# EAGLE design Module_I2C_GPIO (EAGLE 9.6.2)
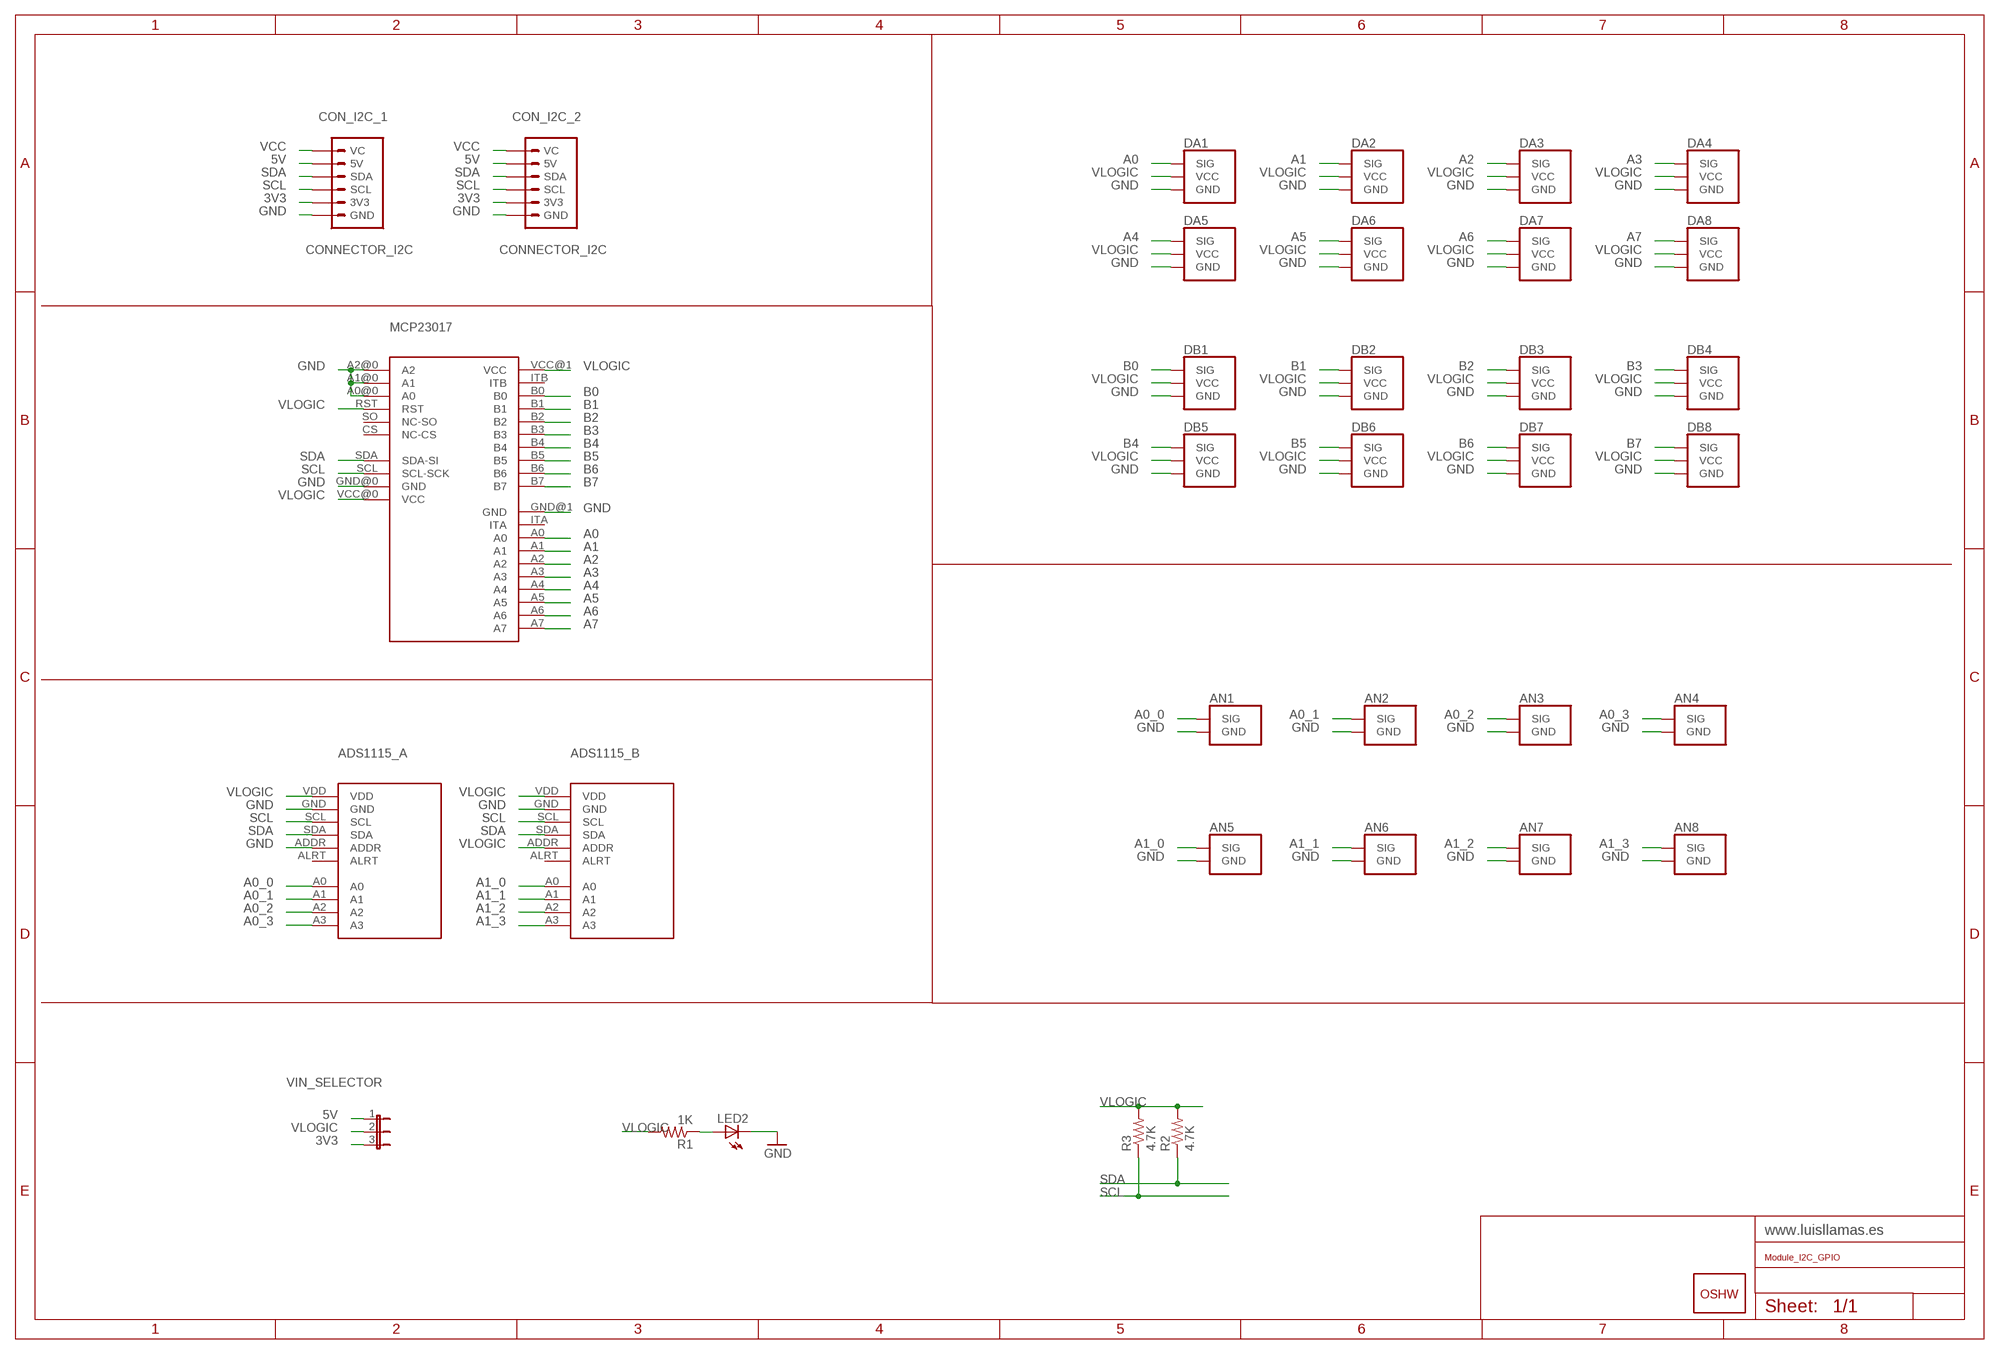
[diagram p0: schematic, sheet 1]

## Parts
ADS1115_A  ADC-4CH-ADS1115  [ADC-4CH-ADS1115]
ADS1115_B  ADC-4CH-ADS1115  [ADC-4CH-ADS1115]
AN1  SERVO_2  [SERVO_2]
AN2  SERVO_2  [SERVO_2]
AN3  SERVO_2  [SERVO_2]
AN4  SERVO_2  [SERVO_2]
AN5  SERVO_2  [SERVO_2]
AN6  SERVO_2  [SERVO_2]
AN7  SERVO_2  [SERVO_2]
AN8  SERVO_2  [SERVO_2]
CON_I2C_1  CONNECTOR_I2C  [CONNECTOR_I2C]
CON_I2C_2  CONNECTOR_I2C  [CONNECTOR_I2C]
DA1  SERVOSERVO  [SERVO]
DA2  SERVOSERVO  [SERVO]
DA3  SERVOSERVO  [SERVO]
DA4  SERVOSERVO  [SERVO]
DA5  SERVOSERVO  [SERVO]
DA6  SERVOSERVO  [SERVO]
DA7  SERVOSERVO  [SERVO]
DA8  SERVOSERVO  [SERVO]
DB1  SERVOSERVO  [SERVO]
DB2  SERVOSERVO  [SERVO]
DB3  SERVOSERVO  [SERVO]
DB4  SERVOSERVO  [SERVO]
DB5  SERVOSERVO  [SERVO]
DB6  SERVOSERVO  [SERVO]
DB7  SERVOSERVO  [SERVO]
DB8  SERVOSERVO  [SERVO]
GOLD_ORB_SM1  OSHWLOGO_GOLD_ORB_MED  [OSHW1]
LED2  LEDCHIP-LED0805  [CHIP-LED0805]
MCP23017  GPIO-I2C-MCP23017  [GPIO-I2C-MCP23017]
R1  1K  R-US_R0805  [R0805]
R2  4.7K  R-US_R0805  [R0805]
R3  4.7K  R-US_R0805  [R0805]
VIN_SELECTOR  JUMPER_3  [JUMPER_3]

## Nets
3V3: CON_I2C_1.3V3 CON_I2C_2.3V3 VIN_SELECTOR.3
5V: CON_I2C_1.5V CON_I2C_2.5V VIN_SELECTOR.1
A0: DA1.SIG MCP23017.A0
A0_0: ADS1115_A.A0 AN1.SIG
A0_1: ADS1115_A.A1 AN2.SIG
A0_2: ADS1115_A.A2 AN3.SIG
A0_3: ADS1115_A.A3 AN4.SIG
A1: DA2.SIG MCP23017.A1
A1_0: ADS1115_B.A0 AN5.SIG
A1_1: ADS1115_B.A1 AN6.SIG
A1_2: ADS1115_B.A2 AN7.SIG
A1_3: ADS1115_B.A3 AN8.SIG
A2: DA3.SIG MCP23017.A2
A3: DA4.SIG MCP23017.A3
A4: DA5.SIG MCP23017.A4
A5: DA6.SIG MCP23017.A5
A6: DA7.SIG MCP23017.A6
A7: DA8.SIG MCP23017.A7
B0: DB1.SIG MCP23017.B0
B1: DB2.SIG MCP23017.B1
B2: DB3.SIG MCP23017.B2
B3: DB4.SIG MCP23017.B3
B4: DB5.SIG MCP23017.B4
B5: DB6.SIG MCP23017.B5
B6: DB7.SIG MCP23017.B6
B7: DB8.SIG MCP23017.B7
GND: ADS1115_A.ADDR ADS1115_A.GND ADS1115_B.GND AN1.GND AN2.GND AN3.GND AN4.GND AN5.GND AN6.GND AN7.GND AN8.GND CON_I2C_1.GND CON_I2C_2.GND DA1.GND DA2.GND DA3.GND DA4.GND DA5.GND DA6.GND DA7.GND DA8.GND DB1.GND DB2.GND DB3.GND DB4.GND DB5.GND DB6.GND DB7.GND DB8.GND LED2.C MCP23017.A0@0(A0) MCP23017.A1@0(A1) MCP23017.A2@0(A2) MCP23017.GND@0(GND) MCP23017.GND@1(GND)
N$1: LED2.A R1.1
SCL: ADS1115_A.SCL ADS1115_B.SCL CON_I2C_1.SCL CON_I2C_2.SCL MCP23017.SCL(SCL-SCK) R3.1
SDA: ADS1115_A.SDA ADS1115_B.SDA CON_I2C_1.SDA CON_I2C_2.SDA MCP23017.SDA(SDA-SI) R2.1
VCC: CON_I2C_1.VC CON_I2C_2.VC
VLOGIC: ADS1115_A.VDD ADS1115_B.ADDR ADS1115_B.VDD DA1.VCC DA2.VCC DA3.VCC DA4.VCC DA5.VCC DA6.VCC DA7.VCC DA8.VCC DB1.VCC DB2.VCC DB3.VCC DB4.VCC DB5.VCC DB6.VCC DB7.VCC DB8.VCC MCP23017.RST MCP23017.VCC@0(VCC) MCP23017.VCC@1(VCC) R1.2 R2.2 R3.2 VIN_SELECTOR.2
Unconnected: ADS1115_A.ALRT ADS1115_B.ALRT MCP23017.CS(NC-CS) MCP23017.ITA MCP23017.ITB MCP23017.SO(NC-SO)

## Library data of the parts
ADS1115_A ADS1115_B = LLL_Modules:ADC-4CH-ADS1115: 4 Channel 16-Bit Analog-to-Digital Converter based on ADS1115 chip Arduino ADS1115 Getting Started Tutorial is available here: http://henrysbench.capnfatz.com/henrys-bench/arduino-voltage-measurements/arduino-ads1115-module-getting-started-tutorial/ ADS1115 datasheet is available here: http://www.ti.com/lit/ds/symlink/ads1115.pdf Click here to find device on ebay.com <http://www.ebay.com/sch/ads1115+module>
AN1-AN8 = LLL_Headers:SERVO_2: Header for servo
CON_I2C_1 CON_I2C_2 = LLL_Connectors:CONNECTOR_I2C
DA1-DA8 DB1-DB8 = LLL_Headers:SERVO: Header for servo
GOLD_ORB_SM1 = LLL_Frames:OSHWLOGO: These are Open-Source Hardware logos.
LED2 = led:LED: LED OSRAM: - CHIPLED LG R971, LG N971, LY N971, LG Q971, LY Q971, LO R971, LY R971 LH N974, LH R974 LS Q976, LO Q976, LY Q976 LO Q996 - Hyper CHIPLED LW Q18S LB Q993, LB Q99A, LB R99A - SideLED LS A670, LO A670, LY A670, LG A670, LP A670 LB A673, LV A673, LT A673, LW A673 LH A674 LY A675 LS A676, LA A676, LO A676, LY A676, LW A676 LS A679, LY A679, LG A679 - Hyper Micro SIDELED® LS Y876, LA Y876, LO Y876, LY Y876 LT Y87S - SmartLED LW L88C, LW L88S LB L89C, LB L89S, LG L890 LS L89K, LO L89K, LY L89K LS L896, LA L896, LO L896, LY L896 - TOPLED LS T670, LO T670, LY T670, LG T670, LP T670 LSG T670, LSP T670, LSY T670, LOP T670, LYG T670 LG T671, LOG T671, LSG T671 LB T673, LV T673, LT T673, LW T673 LH T674 LS T676, LA T676, LO T676, LY T676, LB T676, LH T676, LSB T676, LW T676 LB T67C, LV T67C, LT T67C, LS T67K, LO T67K, LY T67K, LW E67C LS E67B, LA E67B, LO E67B, LY E67B, LB E67C, LV E67C, LT E67C LW T67C LS T679, LY T679, LG T679 LS T770, LO T770, LY T770, LG T770, LP T770 LB T773, LV T773, LT T773, LW T773 LH T774 LS E675, LA E675, LY E675, LS T675 LS T776, LA T776, LO T776, LY T776, LB T776 LHGB T686 LT T68C, LB T68C - Hyper Mini TOPLED® LB M676 - Mini TOPLED Santana® LG M470 LS M47K, LO M47K, LY M47K Source: http://www.osram.convergy.de LUXEON: - LUMILED® LXK2-PW12-R00, LXK2-PW12-S00, LXK2-PW14-U00, LXK2-PW14-V00 LXK2-PM12-R00, LXK2-PM12-S00, LXK2-PM14-U00 LXK2-PE12-Q00, LXK2-PE12-R00, LXK2-PE12-S00, LXK2-PE14-T00, LXK2-PE14-U00 LXK2-PB12-K00, LXK2-PB12-L00, LXK2-PB12-M00, LXK2-PB14-N00, LXK2-PB14-P00, LXK2-PB14-Q00 LXK2-PR12-L00, LXK2-PR12-M00, LXK2-PR14-Q00, LXK2-PR14-R00 LXK2-PD12-Q00, LXK2-PD12-R00, LXK2-PD12-S00 LXK2-PH12-R00, LXK2-PH12-S00 LXK2-PL12-P00, LXK2-PL12-Q00, LXK2-PL12-R00 Source: www.luxeon.com KINGBRIGHT: KA-3528ASYC Source: www.kingbright.com
MCP23017 = LLL_Modules:GPIO-I2C-MCP23017
R1-R3 = adafruit:R-US_: RESISTOR, American symbol
VIN_SELECTOR = LLL_Jumpers:JUMPER_3

## Net classes
0 default: clearance 0.205 mm

## Board
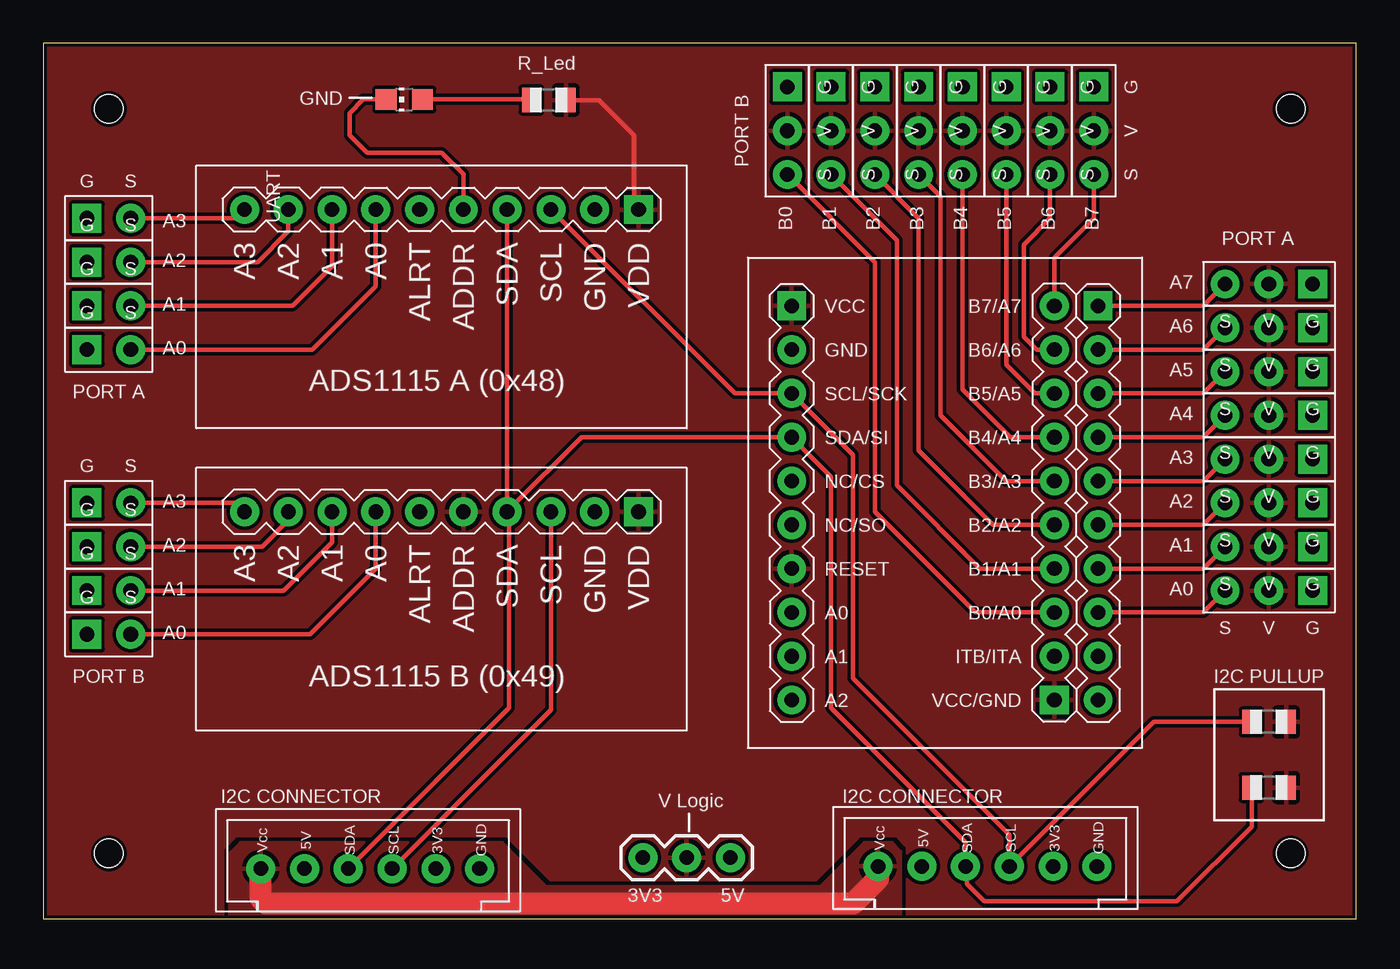
[diagram p1: board, top side]
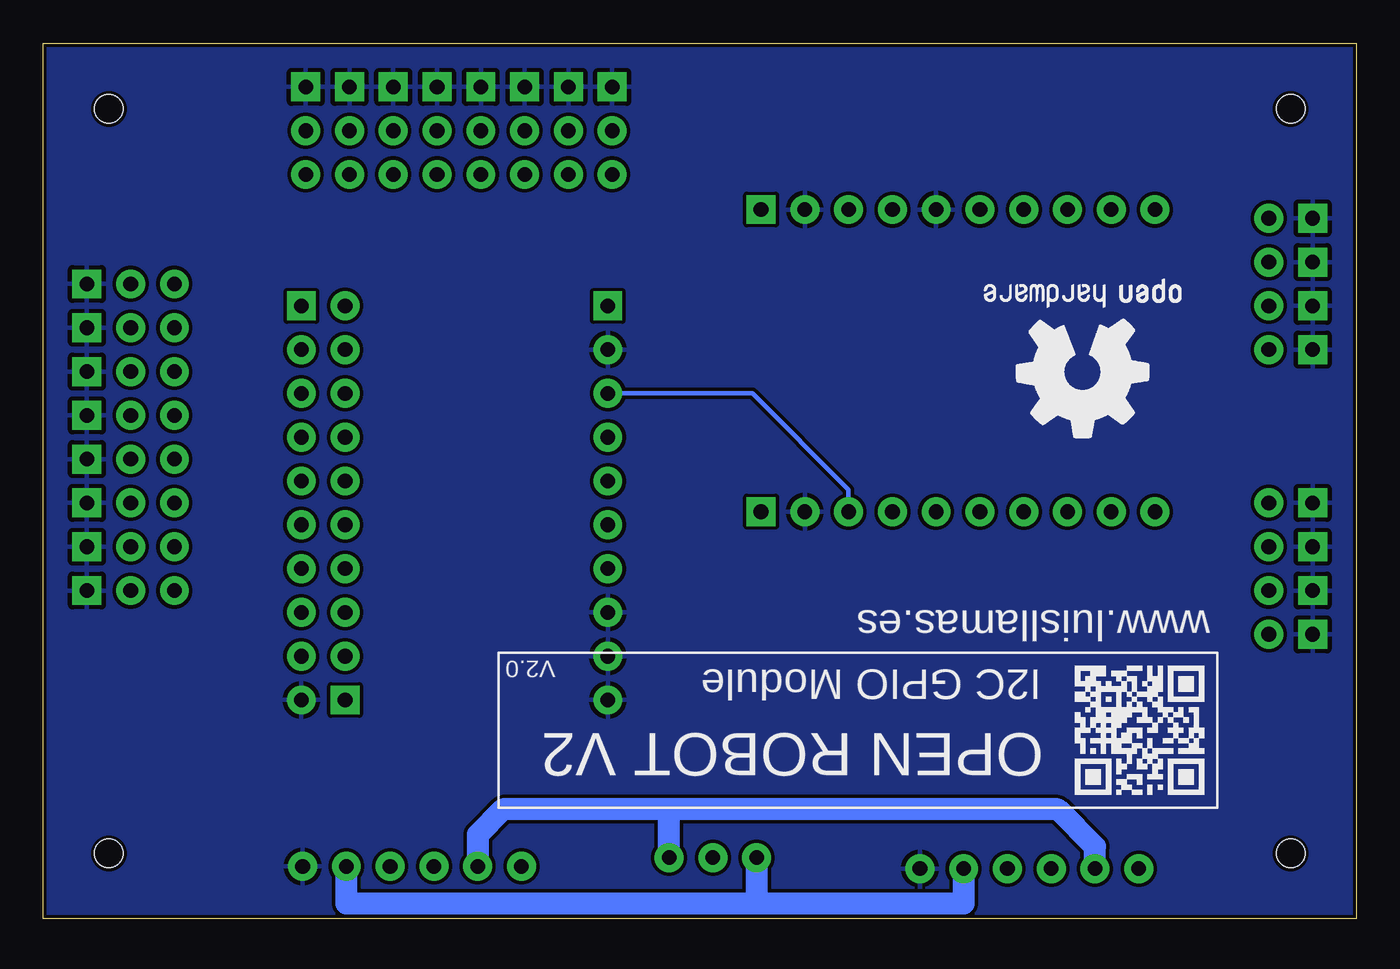
[diagram p2: board, bottom side, seen from below]

Size 76.2 x 50.8 mm. Coordinates in mm from the lower left corner, seen from the top.
Outline: 0,50.8 0,0 76.2,0 76.2,50.8 0,50.8
Copper layers (1*16): Top 0.035559375mm / dielectric 1.6mm / Bottom 0.035559375mm
Design rules "jlcpcb2layer": minimum track width 5mil, minimum drill 12mil, track to track 5mil, track to pad 5mil, pad to pad 5mil, via to via 5mil, smd to smd 5mil, copper to edge 8mil, drill to drill 6mil, minimum pad ring 5mil, minimum via ring 3mil, stop-mask expansion 2.5mil, vias tented up to drill 0mil, thermal gap 10mil
Holes 1.65 mm at 3.81,46.99 3.81,3.81 72.39,46.99 72.39,3.81

### Footprints (pad centres in the part's own frame; a part is rotated, then mirrored left to right if it is on the bottom)
ADC-4CH-ADS1115 = drill 0.85 pad 1.676: A0 -6.35,-3.81; A1 -6.35,-6.35; A2 -6.35,-8.89; A3 -6.35,-11.43; ADDR -6.35,1.27; ALRT -6.35,-1.27; GND -6.35,8.89; SCL -6.35,6.35; SDA -6.35,3.81 | drill 0.85 pad 1.676 square: VDD -6.35,11.43
SERVO_2 = drill 0.85 pad 1.676 square: GND -1.27,0 | drill 0.85 pad 1.676: SIG 1.27,0
CONNECTOR_I2C = drill 0.85 pad 1.676: 3V3 0,3.866; 5V 0,-3.754; GND 0,6.406; SCL 0,1.326; SDA 0,-1.214; VC 0,-6.294
SERVO = drill 0.85 pad 1.676 square: GND -2.54,0 | drill 0.85 pad 1.676: SIG 2.54,0; VCC 0,0
CHIP-LED0805 = smd 1.2 x 1.2: A 0,-1.05; C 0,1.05
GPIO-I2C-MCP23017 = drill 0.85 pad 1.676: A0 11.43,-6.35; A0@0 -6.35,-6.35; A1 11.43,-3.81; A1@0 -6.35,-8.89; A2 11.43,-1.27; A2@0 -6.35,-11.43; A3 11.43,1.27; A4 11.43,3.81; A5 11.43,6.35; A6 11.43,8.89; B0 8.89,-6.35; B1 8.89,-3.81; B2 8.89,-1.27; B3 8.89,1.27; B4 8.89,3.81; B5 8.89,6.35; B6 8.89,8.89; B7 8.89,11.43; CS -6.35,1.27; GND@0 -6.35,8.89; GND@1 11.43,-11.43; ITA 11.43,-8.89; ITB 8.89,-8.89; RST -6.35,-3.81; SCL -6.35,6.35; SDA -6.35,3.81; SO -6.35,-1.27 | drill 0.85 pad 1.676 square: A7 11.43,11.43; VCC@0 -6.35,11.43; VCC@1 8.89,-11.43
R0805 = smd 1.1 x 1.4: 1 -1,0; 2 1,0
JUMPER_3 = drill 0.85 pad 1.676: 1 0,0; 2 2.54,0; 3 5.08,0

### Placement (x,y rotation side)
ADS1115_A  23.11,34.8 270 top
ADS1115_B  23.11,17.27 270 top
AN1  3.81,33.02 0 top
AN2  3.81,35.56 0 top
AN3  3.81,38.1 0 top
AN4  3.81,40.64 0 top
AN5  3.81,16.51 0 top
AN6  3.81,19.05 0 top
AN7  3.81,21.59 0 top
AN8  3.81,24.13 0 top
CON_I2C_1  54.74,3.05 270 top
CON_I2C_2  18.92,2.92 270 top
DA1  71.12,19.05 180 top
DA2  71.12,21.59 180 top
DA3  71.12,24.13 180 top
DA4  71.12,26.67 180 top
DA5  71.12,29.21 180 top
DA6  71.12,31.75 180 top
DA7  71.12,34.29 180 top
DA8  71.12,36.83 180 top
DB1  43.18,45.72 270 top
DB2  45.72,45.72 270 top
DB3  48.26,45.72 270 top
DB4  50.8,45.72 270 top
DB5  53.34,45.72 270 top
DB6  55.88,45.72 270 top
DB7  58.42,45.72 270 top
DB8  60.96,45.72 270 top
GOLD_ORB_SM1  9.53,38.86 180 bottom
LED2  20.95,47.53 90 top
MCP23017  49.78,24.13 0 top
R1  29.34,47.5 0 top
R2  71.12,7.62 0 top
R3  71.12,11.43 0 top
VIN_SELECTOR  39.88,3.56 180 top

### Tracks (layer width: path | path; a pad name or v marks a point on that pad's centre or on a via)
3V3
  Bottom 1.27: CON_I2C_2.3V3 22.79,0.89 34.8,0.89 | CON_I2C_1.3V3 58.6,0.89 34.8,0.89 | VIN_SELECTOR.3 34.8,0.89
5V
  Bottom 1.27: CON_I2C_2.5V 15.17,4.19 17.33,6.35 40.01,6.35 | CON_I2C_1.5V 50.98,4.9 49.53,6.35 40.01,6.35 | VIN_SELECTOR.1 39.88,6.22 40.01,6.35
A0
  Top 0.254: DA1.SIG 67.31,17.78 MCP23017.A0
A0_0
  Top 0.254: AN1.SIG 15.62,33.02 19.3,36.7 ADS1115_A.A0
A0_1
  Top 0.254: ADS1115_A.A1 16.76,37.85 14.48,35.56 AN2.SIG
A0_2
  Top 0.254: AN3.SIG 12.45,38.1 14.22,39.88 ADS1115_A.A2
A0_3
  Top 0.254: ADS1115_A.A3 11.18,40.64 AN4.SIG
A1
  Top 0.254: DA2.SIG 67.31,20.32 MCP23017.A1
A1_0
  Top 0.254: AN5.SIG 15.49,16.51 19.3,20.32 ADS1115_B.A0
A1_1
  Top 0.254: ADS1115_B.A1 16.76,21.84 13.97,19.05 AN6.SIG
A1_2
  Top 0.254: AN7.SIG 12.7,21.59 14.22,23.11 ADS1115_B.A2
A1_3
  Top 0.254: ADS1115_B.A3 11.18,24.13 AN8.SIG
A2
  Top 0.254: DA3.SIG 67.31,22.86 MCP23017.A2
A3
  Top 0.254: DA4.SIG 67.31,25.4 MCP23017.A3
A4
  Top 0.254: DA5.SIG 67.31,27.94 MCP23017.A4
A5
  Top 0.254: DA6.SIG 67.31,30.48 MCP23017.A5
A6
  Top 0.254: DA7.SIG 67.31,33.02 MCP23017.A6
A7
  Top 0.254: DA8.SIG 67.31,35.56 MCP23017.A7
B0
  Top 0.254: MCP23017.B0 54.1,17.78 48.26,23.62 48.26,38.1 DB1.SIG
B1
  Top 0.254: DB2.SIG 49.53,39.37 49.53,25.15 54.36,20.32 MCP23017.B1
B2
  Top 0.254: MCP23017.B2 55.12,22.86 50.8,27.18 50.8,40.64 DB3.SIG
B3
  Top 0.254: DB4.SIG 52.07,41.91 52.07,29.21 55.88,25.4 MCP23017.B3
B4
  Top 0.254: MCP23017.B4 56.13,27.94 53.34,30.73 DB5.SIG
B5
  Top 0.254: MCP23017.B5 57.53,30.48 55.88,32.13 DB6.SIG
B6
  Top 0.254: MCP23017.B6 57.66,33.02 56.9,33.78 56.9,39.12 58.42,40.64 DB7.SIG
B7
  Top 0.254: MCP23017.B7 58.67,38.35 60.96,40.64 DB8.SIG
GND
  Top 0.254: LED2.C 18.57,47.53 17.78,46.74 17.78,45.47 18.8,44.45 23.11,44.45 24.38,43.18 ADS1115_A.ADDR
  pour Bottom (rank 2): 0,0 0,50.8 76.2,50.8 76.2,0
N$1
  Top 0.254: LED2.A 28.3,47.53 R1.1
SCL
  Top 0.254: ADS1115_A.SCL 40.13,30.48 MCP23017.SCL 46.99,26.92 46.99,13.97 56.06,4.9 CON_I2C_1.SCL 64.44,11.43 R3.1 | CON_I2C_2.SCL 29.46,12.14 ADS1115_B.SCL
  Bottom 0.254: ADS1115_B.SCL 29.46,24.89 35.05,30.48 MCP23017.SCL
SDA
  Top 0.254: 27.05,23.75 ADS1115_B.SDA ADS1115_A.SDA | 27.05,23.75 31.24,27.94 MCP23017.SDA 45.72,25.65 45.72,12.25 53.52,4.45 CON_I2C_1.SDA 53.59,2.98 53.59,2.03 54.61,1.02 65.79,1.02 70.12,5.35 R2.1 | CON_I2C_2.SDA 27.05,12.26 27.05,23.75
VCC
  Top 1.27: CON_I2C_1.VC 48.44,2.34 46.99,0.89 12.95,0.89 12.63,1.21 CON_I2C_2.VC
  pour Top: 10.79,0 10.79,3.81 11.43,4.45 26.67,4.45 29.21,1.91 45.09,1.91 47.62,4.45 49.28,4.45 49.78,3.94 49.78,0
VLOGIC
  Top 0.254: ADS1115_A.VDD 34.29,41.4 34.29,45.47 32.26,47.5 R1.2
  pour Top (rank 2): 0,0 0,50.8 76.2,50.8 76.2,0

### Text on the board
tPlace: R_Led | GND | PORT B | UART | A3 | B0 | B1 | B2 | B3 | B4 | B5 | B6 | B7 | PORT A | A2 | A7 | A1 | A6 | A0 | A5 | PORT A | ADS1115 A (0x48) | A4 | A3 | A3 | A2 | A2 | A1 | A1 | A0 | A0 | PORT B | ADS1115 B (0x49) | I2C PULLUP | I2C CONNECTOR | I2C CONNECTOR | V Logic | 3V3 | 5V
bPlace: www.luisllamas.es | V2.0 | I2C GPIO Module | OPEN ROBOT V2